# EAGLE design EM Harp (EAGLE 9.0.1)
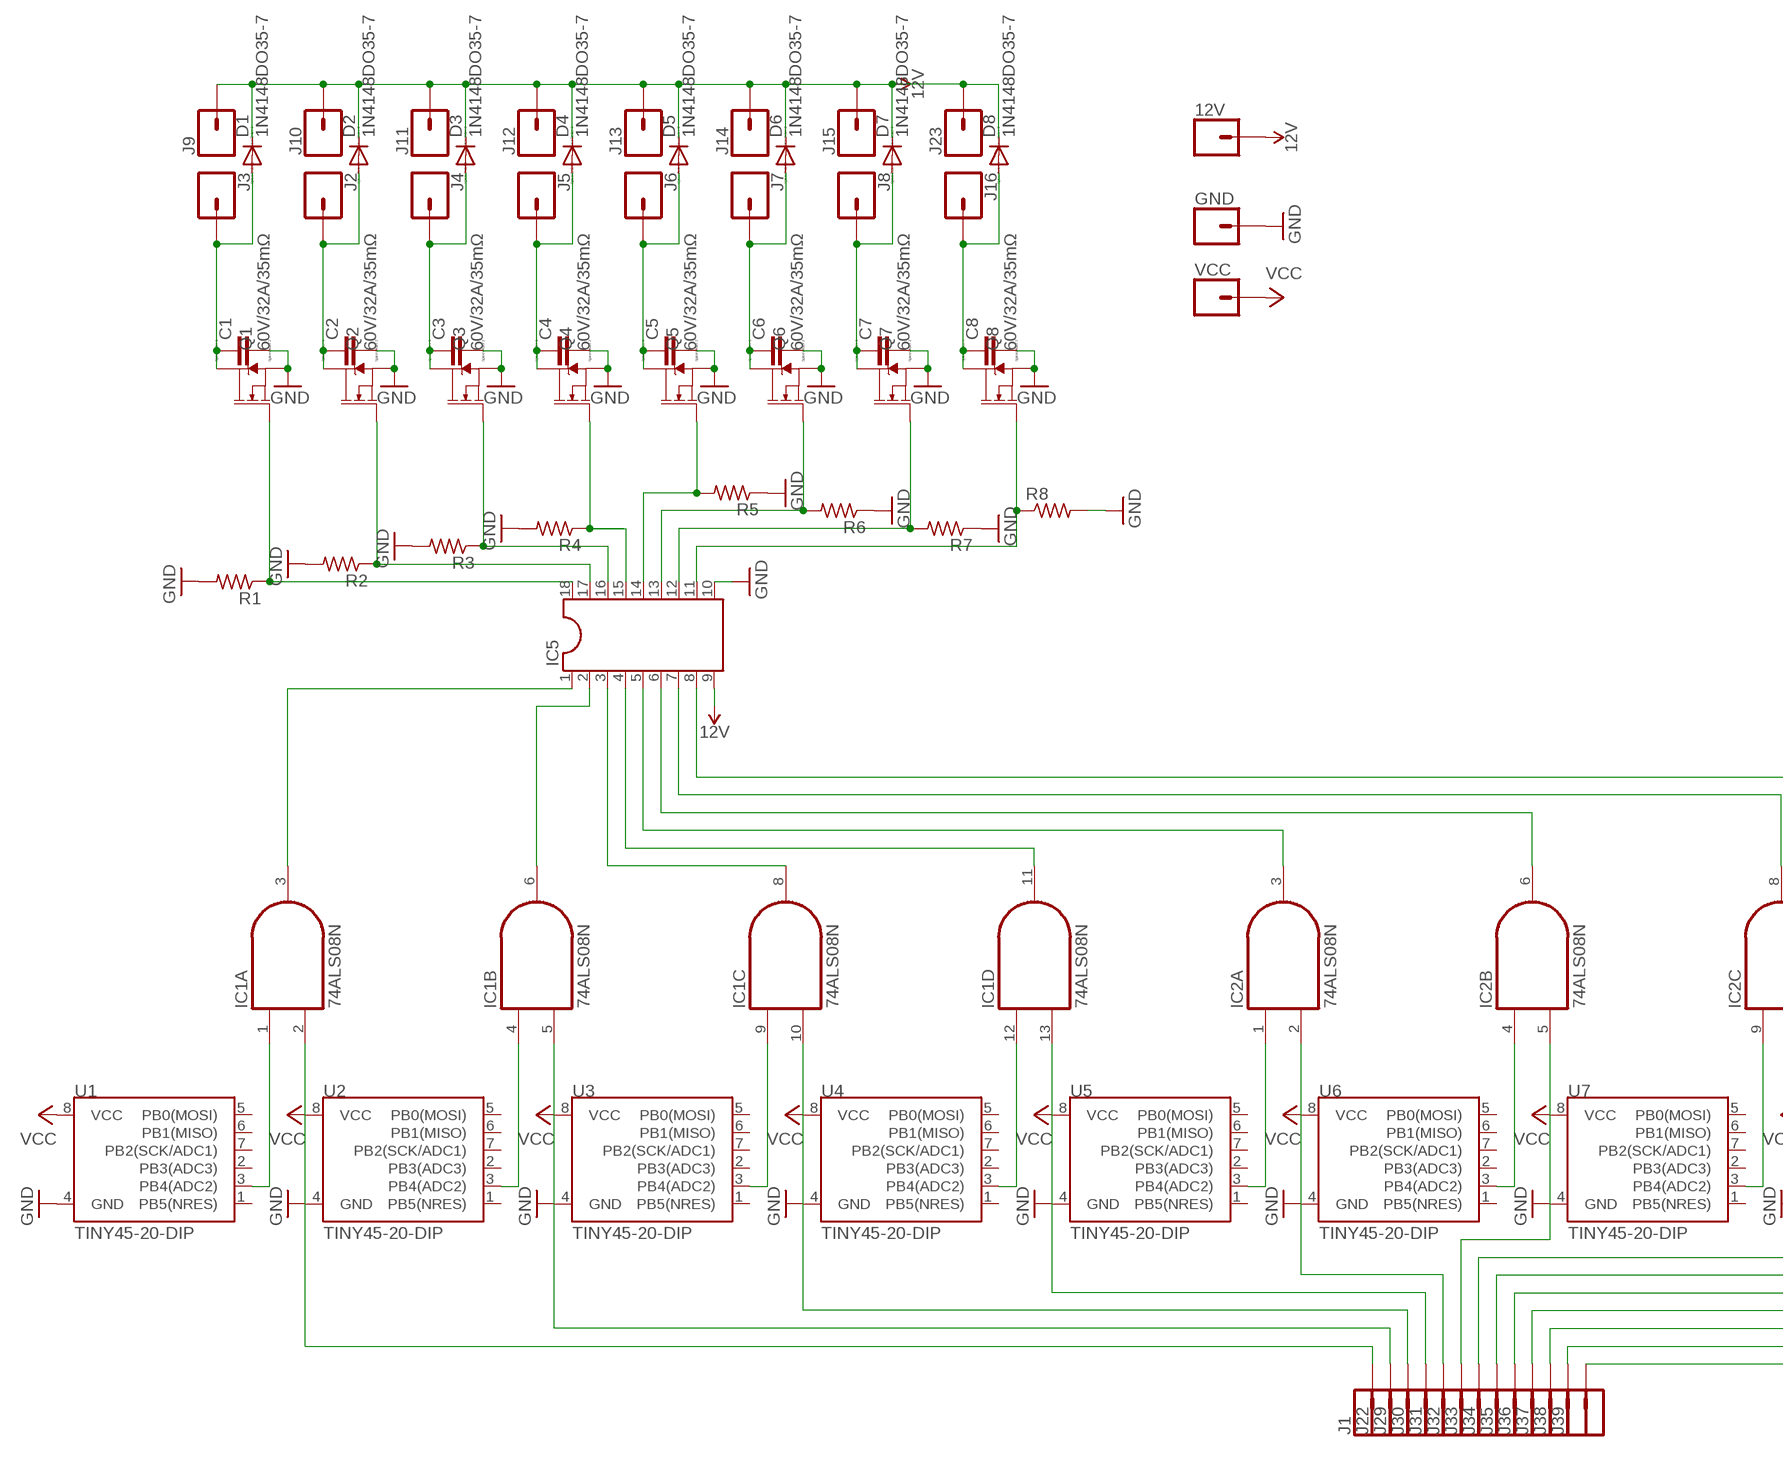
[diagram p0: schematic, sheet 1, part 1 of 2]
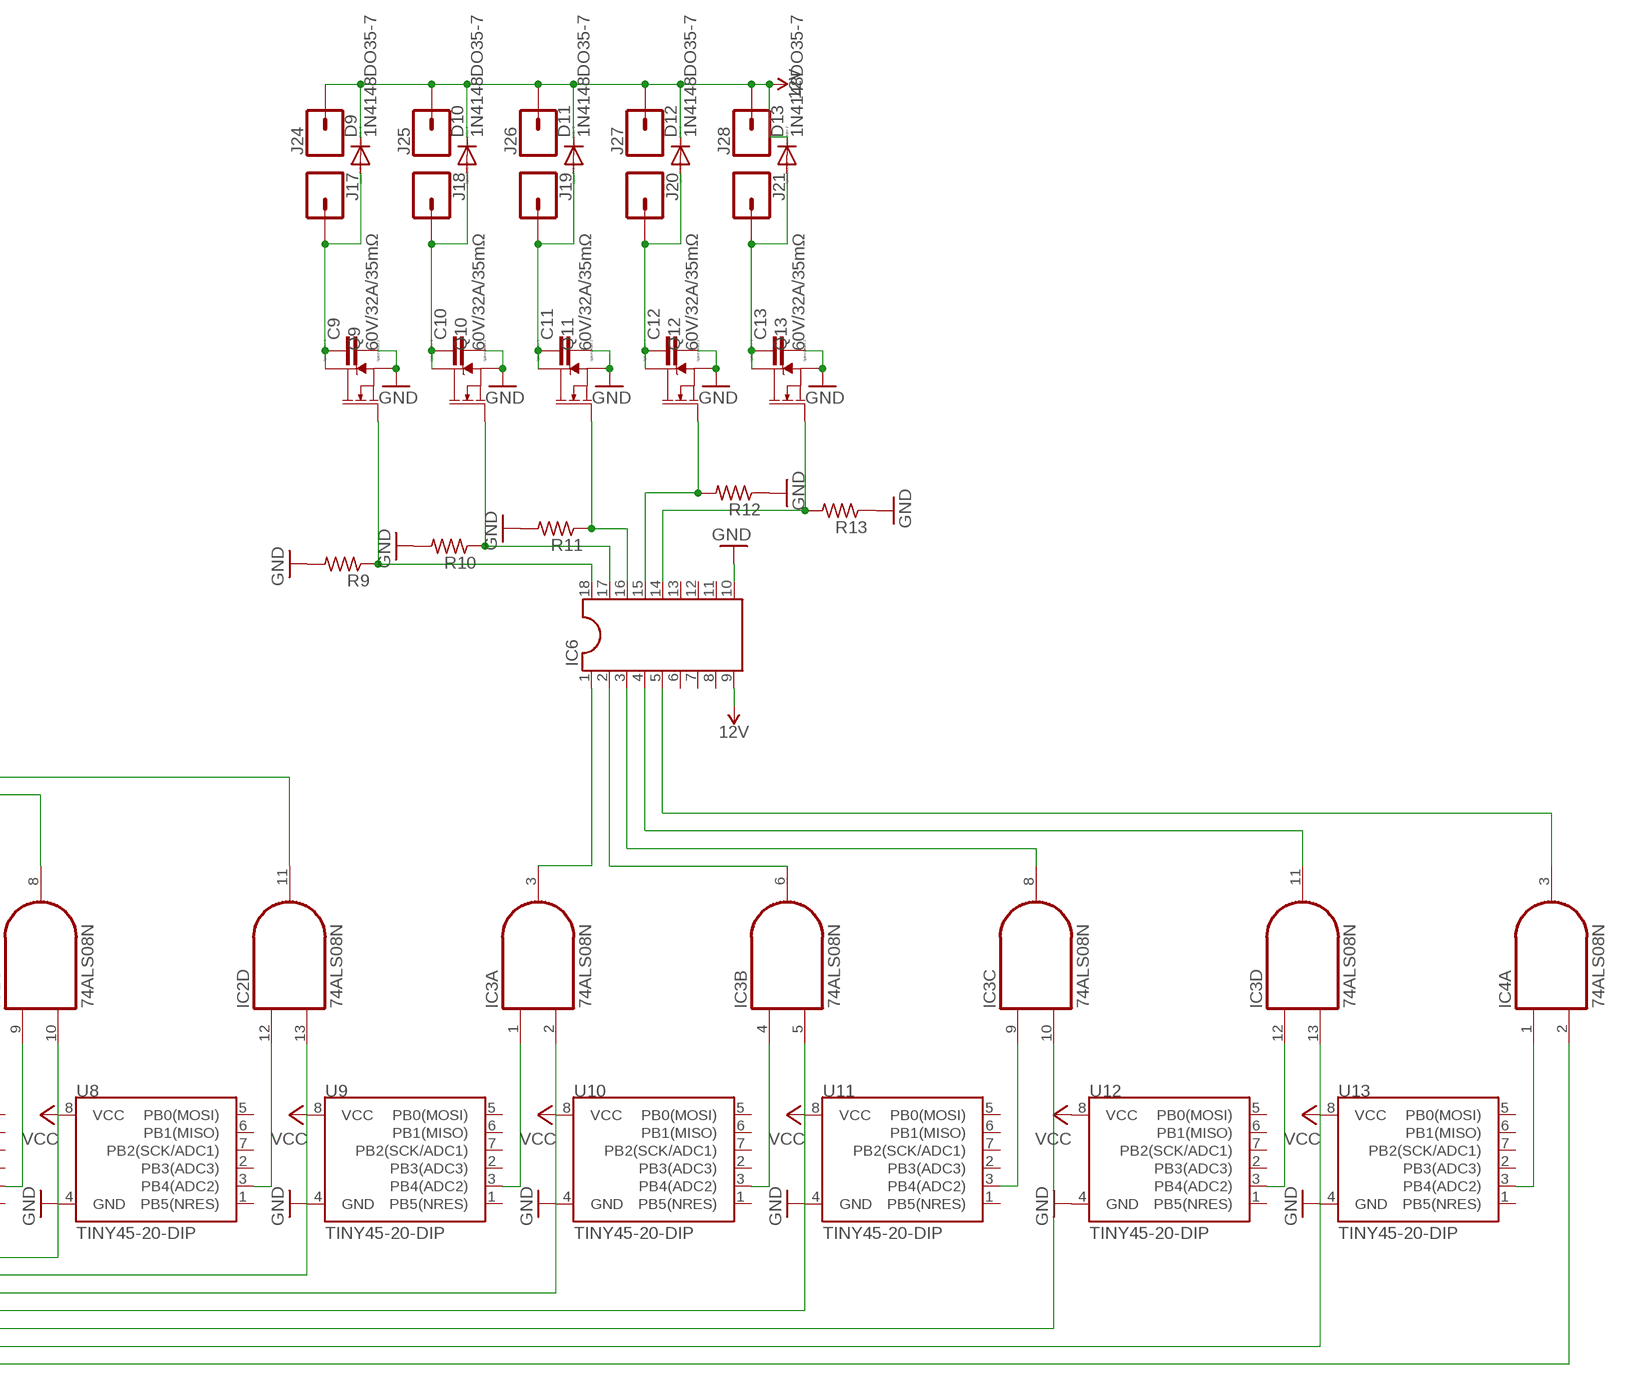
[diagram p1: schematic, sheet 1, part 2 of 2]

## Parts
12V  CONN_01  [1X01]
C1  C  [C0805]
C2  C  [C0805]
C3  C  [C0805]
C4  C  [C0805]
C5  C  [C0805]
C6  C  [C0805]
C7  C  [C0805]
C8  C  [C0805]
C9  C  [C0805]
C10  C  [C0805]
C11  C  [C0805]
C12  C  [C0805]
C13  C  [C0805]
D1  1N4148DO35-7  [DO35-7]
D2  1N4148DO35-7  [DO35-7]
D3  1N4148DO35-7  [DO35-7]
D4  1N4148DO35-7  [DO35-7]
D5  1N4148DO35-7  [DO35-7]
D6  1N4148DO35-7  [DO35-7]
D7  1N4148DO35-7  [DO35-7]
D8  1N4148DO35-7  [DO35-7]
D9  1N4148DO35-7  [DO35-7]
D10  1N4148DO35-7  [DO35-7]
D11  1N4148DO35-7  [DO35-7]
D12  1N4148DO35-7  [DO35-7]
D13  1N4148DO35-7  [DO35-7]
GND  CONN_01  [1X01]
IC1  74ALS08N  [DIL14]
IC2  74ALS08N  [DIL14]
IC3  74ALS08N  [DIL14]
IC4  74ALS08N  [DIL14]
IC5  DIL18  [DIL18]
IC6  DIL18  [DIL18]
J1  CONN_01  [1X01]
J2  CONN_01  [1X01]
J3  CONN_01  [1X01]
J4  CONN_01  [1X01]
J5  CONN_01  [1X01]
J6  CONN_01  [1X01]
J7  CONN_01  [1X01]
J8  CONN_01  [1X01]
J9  CONN_01  [1X01]
J10  CONN_01  [1X01]
J11  CONN_01  [1X01]
J12  CONN_01  [1X01]
J13  CONN_01  [1X01]
J14  CONN_01  [1X01]
J15  CONN_01  [1X01]
J16  CONN_01  [1X01]
J17  CONN_01  [1X01]
J18  CONN_01  [1X01]
J19  CONN_01  [1X01]
J20  CONN_01  [1X01]
J21  CONN_01  [1X01]
J22  CONN_01  [1X01]
J23  CONN_01  [1X01]
J24  CONN_01  [1X01]
J25  CONN_01  [1X01]
J26  CONN_01  [1X01]
J27  CONN_01  [1X01]
J28  CONN_01  [1X01]
J29  CONN_01  [1X01]
J30  CONN_01  [1X01]
J31  CONN_01  [1X01]
J32  CONN_01  [1X01]
J33  CONN_01  [1X01]
J34  CONN_01  [1X01]
J35  CONN_01  [1X01]
J36  CONN_01  [1X01]
J37  CONN_01  [1X01]
J38  CONN_01  [1X01]
J39  CONN_01  [1X01]
Q1  60V/32A/35mΩ  MOSFET-NCH-FQP30N06L  [TO220V]
Q2  60V/32A/35mΩ  MOSFET-NCH-FQP30N06L  [TO220V]
Q3  60V/32A/35mΩ  MOSFET-NCH-FQP30N06L  [TO220V]
Q4  60V/32A/35mΩ  MOSFET-NCH-FQP30N06L  [TO220V]
Q5  60V/32A/35mΩ  MOSFET-NCH-FQP30N06L  [TO220V]
Q6  60V/32A/35mΩ  MOSFET-NCH-FQP30N06L  [TO220V]
Q7  60V/32A/35mΩ  MOSFET-NCH-FQP30N06L  [TO220V]
Q8  60V/32A/35mΩ  MOSFET-NCH-FQP30N06L  [TO220V]
Q9  60V/32A/35mΩ  MOSFET-NCH-FQP30N06L  [TO220V]
Q10  60V/32A/35mΩ  MOSFET-NCH-FQP30N06L  [TO220V]
Q11  60V/32A/35mΩ  MOSFET-NCH-FQP30N06L  [TO220V]
Q12  60V/32A/35mΩ  MOSFET-NCH-FQP30N06L  [TO220V]
Q13  60V/32A/35mΩ  MOSFET-NCH-FQP30N06L  [TO220V]
R1  R-US_M0805  [M0805]
R2  R-US_R0805  [R0805]
R3  R-US_R0805  [R0805]
R4  R-US_R0805  [R0805]
R5  R-US_R0805  [R0805]
R6  R-US_R0805  [R0805]
R7  R-US_R0805  [R0805]
R8  R-US_R0805  [R0805]
R9  R-US_R0805  [R0805]
R10  R-US_R0805  [R0805]
R11  R-US_R0805  [R0805]
R12  R-US_R0805  [R0805]
R13  R-US_R0805  [R0805]
U1  TINY45-20-DIP  ATTINY45TINY45-20-DIP  [DIP08_MCU]
U2  TINY45-20-DIP  ATTINY45TINY45-20-DIP  [DIP08_MCU]
U3  TINY45-20-DIP  ATTINY45TINY45-20-DIP  [DIP08_MCU]
U4  TINY45-20-DIP  ATTINY45TINY45-20-DIP  [DIP08_MCU]
U5  TINY45-20-DIP  ATTINY45TINY45-20-DIP  [DIP08_MCU]
U6  TINY45-20-DIP  ATTINY45TINY45-20-DIP  [DIP08_MCU]
U7  TINY45-20-DIP  ATTINY45TINY45-20-DIP  [DIP08_MCU]
U8  TINY45-20-DIP  ATTINY45TINY45-20-DIP  [DIP08_MCU]
U9  TINY45-20-DIP  ATTINY45TINY45-20-DIP  [DIP08_MCU]
U10  TINY45-20-DIP  ATTINY45TINY45-20-DIP  [DIP08_MCU]
U11  TINY45-20-DIP  ATTINY45TINY45-20-DIP  [DIP08_MCU]
U12  TINY45-20-DIP  ATTINY45TINY45-20-DIP  [DIP08_MCU]
U13  TINY45-20-DIP  ATTINY45TINY45-20-DIP  [DIP08_MCU]
VCC  CONN_01  [1X01]

## Nets
12V: 12V.1 D1.C D2.C D3.C D4.C D5.C D6.C D7.C D8.C D9.C D10.C D11.C D12.C D13.C IC5.9 IC6.9 J9.1 J10.1 J11.1 J12.1 J13.1 J14.1 J15.1 J23.1 J24.1 J25.1 J26.1 J27.1 J28.1
GND: C1.2 C2.2 C3.2 C4.2 C5.2 C6.2 C7.2 C8.2 C9.2 C10.2 C11.2 C12.2 C13.2 GND.1 IC5.10 IC6.10 Q1.3(S) Q2.3(S) Q3.3(S) Q4.3(S) Q5.3(S) Q6.3(S) Q7.3(S) Q8.3(S) Q9.3(S) Q10.3(S) Q11.3(S) Q12.3(S) Q13.3(S) R1.2 R2.2 R3.2 R4.2 R5.1 R6.1 R7.1 R8.2 R9.2 R10.2 R11.2 R12.1 R13.1 U1.4(GND) U2.4(GND) U3.4(GND) U4.4(GND) U5.4(GND) U6.4(GND) U7.4(GND) U8.4(GND) U9.4(GND) U10.4(GND) U11.4(GND) U12.4(GND) U13.4(GND)
N$1: IC1.1(A:I0) U1.3(PB4(ADC2))
N$2: IC1.4(B:I0) U2.3(PB4(ADC2))
N$3: IC1.9(C:I0) U3.3(PB4(ADC2))
N$4: IC1.12(D:I0) U4.3(PB4(ADC2))
N$5: IC2.1(A:I0) U5.3(PB4(ADC2))
N$6: IC2.4(B:I0) U6.3(PB4(ADC2))
N$7: IC2.9(C:I0) U7.3(PB4(ADC2))
N$8: IC2.12(D:I0) U8.3(PB4(ADC2))
N$9: IC3.1(A:I0) U9.3(PB4(ADC2))
N$10: IC3.4(B:I0) U10.3(PB4(ADC2))
N$11: IC3.9(C:I0) U11.3(PB4(ADC2))
N$12: IC3.12(D:I0) U12.3(PB4(ADC2))
N$13: IC4.1(A:I0) U13.3(PB4(ADC2))
N$14: IC1.2(A:I1) J1.1
N$15: IC1.5(B:I1) J22.1
N$16: IC1.10(C:I1) J29.1
N$17: IC1.13(D:I1) J30.1
N$18: IC2.2(A:I1) J31.1
N$19: IC2.5(B:I1) J32.1
N$20: IC2.10(C:I1) J33.1
N$21: IC2.13(D:I1) J34.1
N$22: IC3.2(A:I1) J35.1
N$23: IC3.5(B:I1) J36.1
N$24: IC3.10(C:I1) J37.1
N$25: IC3.13(D:I1) J38.1
N$26: IC4.2(A:I1) J39.1
N$27: IC1.3(A:O) IC5.1
N$28: IC1.6(B:O) IC5.2
N$29: IC1.8(C:O) IC5.3
N$30: IC1.11(D:O) IC5.4
N$31: IC2.3(A:O) IC5.5
N$32: IC2.6(B:O) IC5.6
N$33: IC2.8(C:O) IC5.7
N$34: IC2.11(D:O) IC5.8
N$35: IC3.3(A:O) IC6.1
N$37: IC3.6(B:O) IC6.2
N$38: IC3.8(C:O) IC6.3
N$39: IC3.11(D:O) IC6.4
N$40: IC4.3(A:O) IC6.5
N$42: IC5.18 Q1.1(G) R1.1
N$43: IC5.17 Q2.1(G) R2.1
N$44: IC5.16 Q3.1(G) R3.1
N$45: IC5.15 Q4.1(G) R4.1
N$46: IC5.14 Q5.1(G) R5.2
N$47: IC5.13 Q6.1(G) R6.2
N$48: IC5.12 Q7.1(G) R7.2
N$49: C1.1 D1.A J3.1 Q1.2(D)
N$51: IC6.18 Q9.1(G) R9.1
N$52: IC6.17 Q10.1(G) R10.1
N$53: IC6.16 Q11.1(G) R11.1
N$54: IC6.15 Q12.1(G) R12.2
N$55: IC6.14 Q13.1(G) R13.2
N$57: C7.1 D7.A J8.1 Q7.2(D)
N$58: C6.1 D6.A J7.1 Q6.2(D)
N$59: C5.1 D5.A J6.1 Q5.2(D)
N$60: C4.1 D4.A J5.1 Q4.2(D)
N$61: C3.1 D3.A J4.1 Q3.2(D)
N$62: C2.1 D2.A J2.1 Q2.2(D)
N$63: C8.1 D8.A J16.1 Q8.2(D)
N$65: C13.1 D13.A J21.1 Q13.2(D)
N$66: C12.1 D12.A J20.1 Q12.2(D)
N$67: C11.1 D11.A J19.1 Q11.2(D)
N$68: C10.1 D10.A J18.1 Q10.2(D)
N$69: C9.1 D9.A J17.1 Q9.2(D)
N$79: IC5.11 Q8.1(G) R8.1
VCC: U1.8(VCC) U2.8(VCC) U3.8(VCC) U4.8(VCC) U5.8(VCC) U6.8(VCC) U7.8(VCC) U8.8(VCC) U9.8(VCC) U10.8(VCC) U11.8(VCC) U12.8(VCC) U13.8(VCC) VCC.1
Unconnected: IC4.4(B:I0) IC4.5(B:I1) IC4.6(B:O) IC4.8(C:O) IC4.9(C:I0) IC4.10(C:I1) IC4.11(D:O) IC4.12(D:I0) IC4.13(D:I1) IC6.6 IC6.7 IC6.8 IC6.11 IC6.12 IC6.13 U1.1(PB5(NRES)) U1.2(PB3(ADC3)) U1.5(PB0(MOSI)) U1.6(PB1(MISO)) U1.7(PB2(SCK/ADC1)) U2.1(PB5(NRES)) U2.2(PB3(ADC3)) U2.5(PB0(MOSI)) U2.6(PB1(MISO)) U2.7(PB2(SCK/ADC1)) U3.1(PB5(NRES)) U3.2(PB3(ADC3)) U3.5(PB0(MOSI)) U3.6(PB1(MISO)) U3.7(PB2(SCK/ADC1)) U4.1(PB5(NRES)) U4.2(PB3(ADC3)) U4.5(PB0(MOSI)) U4.6(PB1(MISO)) U4.7(PB2(SCK/ADC1)) U5.1(PB5(NRES)) U5.2(PB3(ADC3)) U5.5(PB0(MOSI)) U5.6(PB1(MISO)) U5.7(PB2(SCK/ADC1)) U6.1(PB5(NRES)) U6.2(PB3(ADC3)) U6.5(PB0(MOSI)) U6.6(PB1(MISO)) U6.7(PB2(SCK/ADC1)) U7.1(PB5(NRES)) U7.2(PB3(ADC3)) U7.5(PB0(MOSI)) U7.6(PB1(MISO)) U7.7(PB2(SCK/ADC1)) U8.1(PB5(NRES)) U8.2(PB3(ADC3)) U8.5(PB0(MOSI)) U8.6(PB1(MISO)) U8.7(PB2(SCK/ADC1)) U9.1(PB5(NRES)) U9.2(PB3(ADC3)) U9.5(PB0(MOSI)) U9.6(PB1(MISO)) U9.7(PB2(SCK/ADC1)) U10.1(PB5(NRES)) U10.2(PB3(ADC3)) U10.5(PB0(MOSI)) U10.6(PB1(MISO)) U10.7(PB2(SCK/ADC1)) U11.1(PB5(NRES)) U11.2(PB3(ADC3)) U11.5(PB0(MOSI)) U11.6(PB1(MISO)) U11.7(PB2(SCK/ADC1)) U12.1(PB5(NRES)) U12.2(PB3(ADC3)) U12.5(PB0(MOSI)) U12.6(PB1(MISO)) U12.7(PB2(SCK/ADC1)) U13.1(PB5(NRES)) U13.2(PB3(ADC3)) U13.5(PB0(MOSI)) U13.6(PB1(MISO)) U13.7(PB2(SCK/ADC1))

## Power pins joined to a net without a drawn wire
GND: IC1.7(P:GND) IC2.7(P:GND) IC3.7(P:GND) IC4.7(P:GND)
VCC: IC1.14(P:VCC) IC2.14(P:VCC) IC3.14(P:VCC) IC4.14(P:VCC)

## Library data of the parts
12V GND J1-J39 VCC = SparkFun-Connectors:CONN_01: Single connection point. Often used as Generic Header-pin footprint for 0.1 inch spaced/style header connections On any of the 0.1 inch spaced packages, you can populate with these: Break Away Headers - Straight <https://www.sparkfun.com/products/116> (PRT-00116) Break Away Male Headers - Right Angle <https://www.sparkfun.com/products/553> (PRT-00553) Female Headers <https://www.sparkfun.com/products/115> (PRT-00115) Break Away Headers - Machine Pin <https://www.sparkfun.com/products/117> (PRT-00117) Break Away Female Headers - Swiss Machine Pin <https://www.sparkfun.com/products/743> (PRT-00743) This device is also useful as a general connection point to wire up your design to another part of your project. Our various solder wires solder well into these plated through hole pads. Hook-Up Wire - Assortment (Stranded, 22 AWG) <https://www.sparkfun.com/products/11375> (PRT-11375) Hook-Up Wire - Assortment (Solid Core, 22 AWG) <https://www.sparkfun.com/products/11367> (PRT-11367) View the entire wire category on our website here <https://www.sparkfun.com/categories/141> Special notes: SMTSO-256-ET is a "flush mount" nut for a 4-40 screw. We mostly use this on specialty testbeds; it is a nice way to connect hardware to your PCB at an adjustable hieght. Also note, the SNAP packages are for using a snappable style connector. We sell a baggie of snaps and they are also used on two LilyPad designs: Snap Assortment - 30 pack (male and female) <https://www.sparkfun.com/products/11347> (DEV-11347) LilyPad Arduino SimpleSnap <https://www.sparkfun.com/products/10941> (DEV-10941) LilyPad SimpleSnap Protoboard <https://www.sparkfun.com/products/10940> (DEV-10940)
C1-C13 = eagle-ltspice:C: CAPACITOR, European symbol; SPICEMODEL: NONE; SPICEPREFIX: C
D1-D13 = diode:1N4148: DIODE high speed (Philips)
IC1-IC4 = 74xx-us:74*08: Quad 2-input AND gate
IC5 IC6 = ic-package:DIL18: Dual In Line / Socket
Q1-Q13 = SparkFun-DiscreteSemi:MOSFET-NCH: N-channel MOSFETs Voltage controlled devices that allow control of high current outputs. SparkFun Products: SparkFun OpenScale <https://www.sparkfun.com/products/13261> SparkFun Digital Sandbox <https://www.sparkfun.com/products/12651> SparkFun Monster Moto Shield <https://www.sparkfun.com/products/10182> SparkFun MOSFET Power Controller <https://www.sparkfun.com/products/11214>; PROD_ID: TRANS-10060
R1-R13 = rcl:R-US_: RESISTOR, American symbol; SPICEPREFIX: R
U1-U13 = SparkFun-Retired:ATTINY45: Atmel 8-pin 2/4/8kB flash uC Retired; PROD_ID: IC-09439

## Board
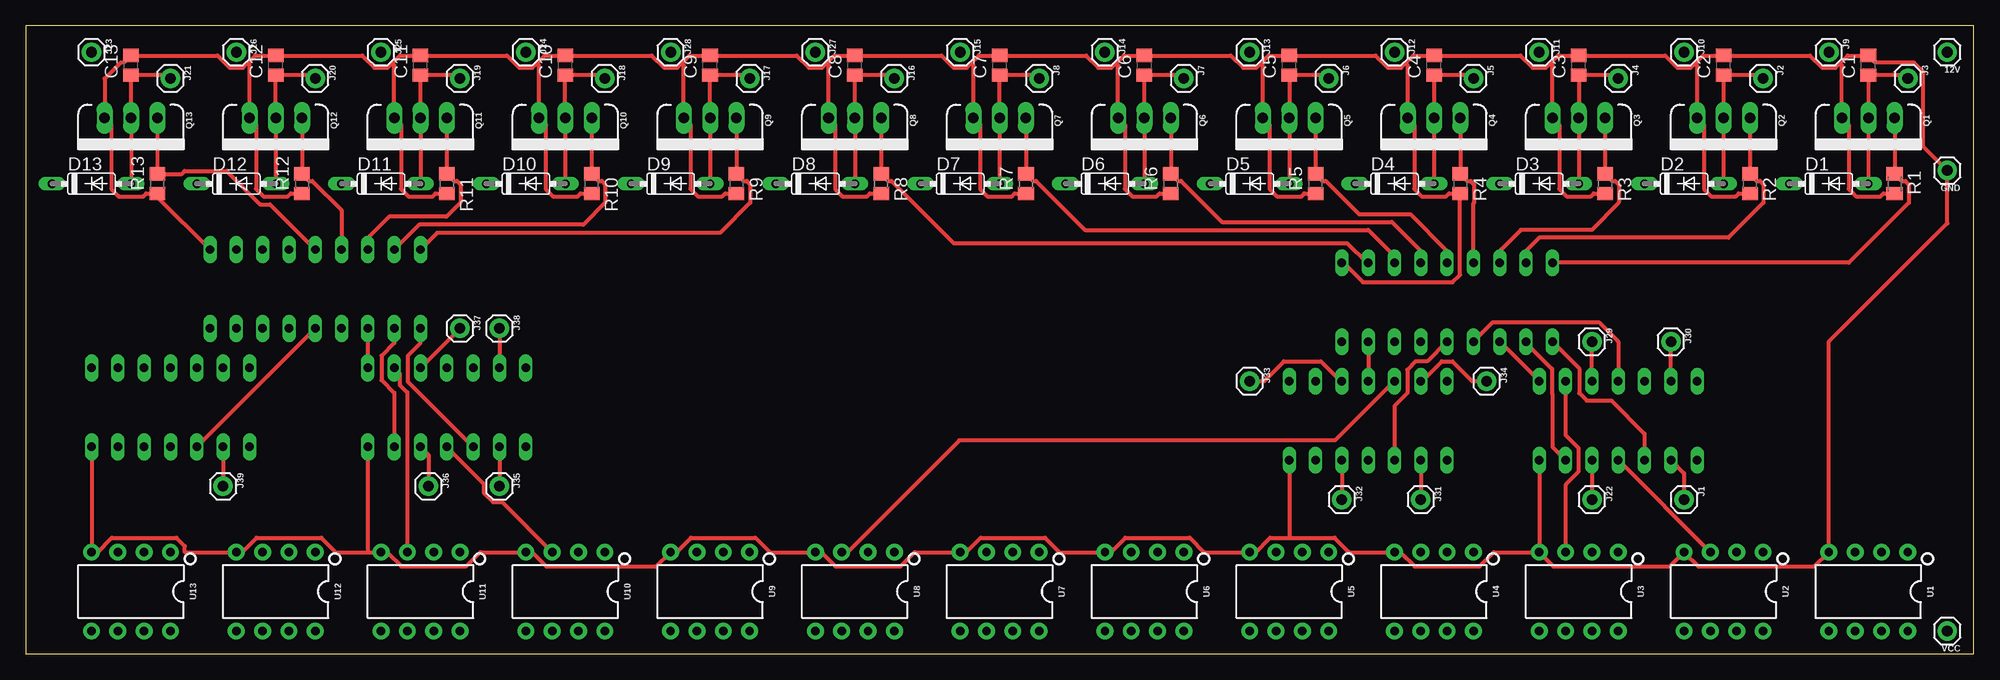
[diagram p2: board, top side]
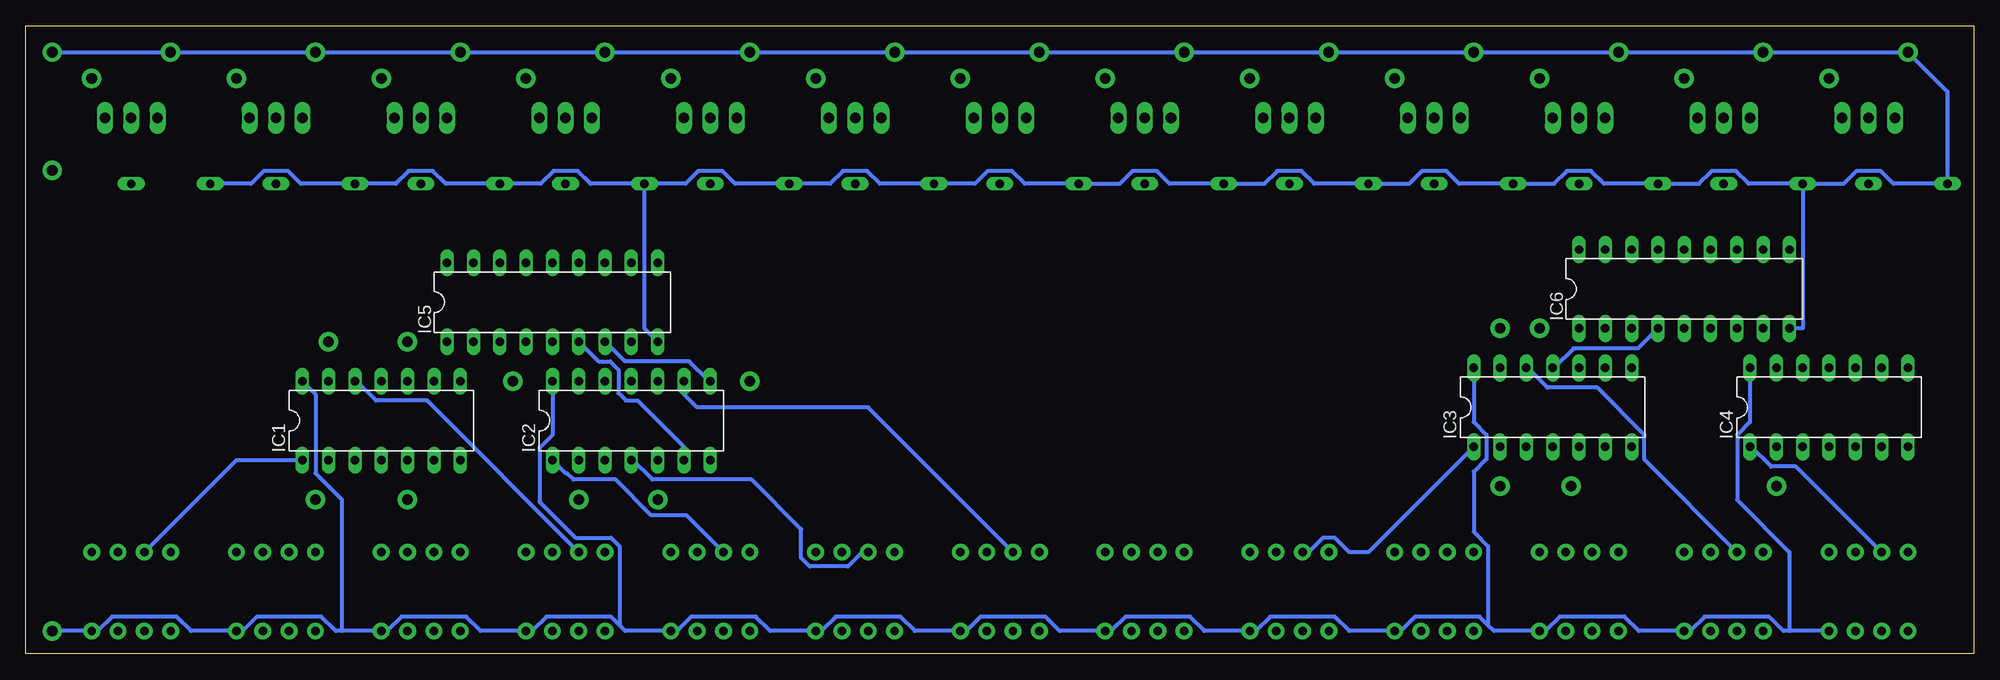
[diagram p3: board, bottom side, seen from below]

Size 187.94 x 60.63 mm. Coordinates in mm from the lower left corner, seen from the top.
Outline: 187.94,60.63 0,60.63 0,0 187.94,0 187.94,60.63
Copper layers (1*16): Top 0.035mm / dielectric 1.5mm / Bottom 0.035mm
Design rules "default *": minimum track width 10mil, minimum drill 0.35mm, track to track 15mil, track to pad 15mil, pad to pad 15mil, via to via 15mil, smd to smd 6mil, copper to edge 20mil, drill to drill 6mil, minimum pad ring 10mil, minimum via ring 8mil, stop-mask expansion 4mil, vias tented up to drill 0mil, thermal gap 10mil

### Footprints (pad centres in the part's own frame; a part is rotated, then mirrored left to right if it is on the bottom)
1X01 = drill 1.016 pad 1.88: 1 0,0
C0805 = smd 1.3 x 1.5: 1 -0.95,0; 2 0.95,0
DO35-7 = drill 0.813 long: A 3.81,0; C -3.81,0
DIL14 = drill 0.813 long: 1 -7.62,-3.81; 2 -5.08,-3.81; 3 -2.54,-3.81; 4 0,-3.81; 5 2.54,-3.81; 6 5.08,-3.81; 7 7.62,-3.81; 8 7.62,3.81; 9 5.08,3.81; 10 2.54,3.81; 11 0,3.81; 12 -2.54,3.81; 13 -5.08,3.81; 14 -7.62,3.81
DIL18 = drill 0.813 long: 1 -10.16,-3.81; 2 -7.62,-3.81; 3 -5.08,-3.81; 4 -2.54,-3.81; 5 0,-3.81; 6 2.54,-3.81; 7 5.08,-3.81; 8 7.62,-3.81; 9 10.16,-3.81; 10 10.16,3.81; 11 7.62,3.81; 12 5.08,3.81; 13 2.54,3.81; 14 0,3.81; 15 -2.54,3.81; 16 -5.08,3.81; 17 -7.62,3.81; 18 -10.16,3.81
TO220V = drill 1.016 long: 1 -2.54,0; 2 0,0; 3 2.54,0
M0805 = smd 1.3 x 1.6: 1 -0.95,0; 2 0.95,0
R0805 = smd 1.3 x 1.5: 1 -0.95,0; 2 0.95,0
DIP08_MCU = drill 0.813 pad 1.626: 1 -3.81,-3.81; 2 -1.27,-3.81; 3 1.27,-3.81; 4 3.81,-3.81; 5 3.81,3.81; 6 1.27,3.81; 7 -1.27,3.81; 8 -3.81,3.81

### Placement (x,y rotation side)
12V  185.4,58.09 180 top
C1  177.78,56.82 90 top
C2  163.81,56.82 90 top
C3  149.84,56.82 90 top
C4  135.87,56.82 90 top
C5  121.9,56.82 90 top
C6  107.93,56.82 90 top
C7  93.96,56.82 90 top
C8  79.99,56.82 90 top
C9  66.02,56.82 90 top
C10  52.05,56.82 90 top
C11  38.08,56.82 90 top
C12  24.11,56.82 90 top
C13  10.14,56.82 90 top
D1  173.97,45.39 0 top
D2  160,45.39 0 top
D3  146.03,45.39 0 top
D4  132.06,45.39 0 top
D5  118.09,45.39 0 top
D6  104.12,45.39 0 top
D7  90.15,45.39 0 top
D8  76.18,45.39 0 top
D9  62.21,45.39 0 top
D10  48.24,45.39 0 top
D11  34.27,45.39 0 top
D12  20.3,45.39 0 top
D13  6.33,45.39 0 top
GND  185.4,46.66 180 top
IC1  153.65,22.53 0 bottom
IC2  129.52,22.53 0 bottom
IC3  40.62,23.8 0 bottom
IC4  13.95,23.8 0 bottom
IC5  137.14,33.96 0 bottom
IC6  27.92,35.23 0 bottom
J1  160,14.91 270 top
J2  167.62,55.55 270 top
J3  181.59,55.55 270 top
J4  153.65,55.55 270 top
J5  139.68,55.55 270 top
J6  125.71,55.55 270 top
J7  111.74,55.55 270 top
J8  97.77,55.55 270 top
J9  173.97,58.09 270 top
J10  160,58.09 270 top
J11  146.03,58.09 270 top
J12  132.06,58.09 270 top
J13  118.09,58.09 270 top
J14  104.12,58.09 270 top
J15  90.15,58.09 270 top
J16  83.8,55.55 270 top
J17  69.83,55.55 270 top
J18  55.86,55.55 270 top
J19  41.89,55.55 270 top
J20  27.92,55.55 270 top
J21  13.95,55.55 270 top
J22  151.11,14.91 270 top
J23  6.33,58.09 270 top
J24  48.24,58.09 270 top
J25  34.27,58.09 270 top
J26  20.3,58.09 270 top
J27  76.18,58.09 270 top
J28  62.21,58.09 270 top
J29  151.11,30.15 270 top
J30  158.73,30.15 270 top
J31  134.6,14.91 270 top
J32  126.98,14.91 270 top
J33  118.09,26.34 270 top
J34  140.95,26.34 270 top
J35  45.7,16.18 270 top
J36  38.84,16.18 270 top
J37  41.89,31.42 270 top
J38  45.7,31.42 270 top
J39  19.03,16.18 270 top
Q1  177.78,51.74 180 top
Q2  163.81,51.74 180 top
Q3  149.84,51.74 180 top
Q4  135.87,51.74 180 top
Q5  121.9,51.74 180 top
Q6  107.93,51.74 180 top
Q7  93.96,51.74 180 top
Q8  79.99,51.74 180 top
Q9  66.02,51.74 180 top
Q10  52.05,51.74 180 top
Q11  38.08,51.74 180 top
Q12  24.11,51.74 180 top
Q13  10.14,51.74 180 top
R1  180.32,45.39 270 top
R2  166.35,45.39 270 top
R3  152.38,45.39 270 top
R4  138.41,45.39 270 top
R5  124.44,45.39 90 top
R6  110.47,45.39 90 top
R7  96.5,45.39 90 top
R8  82.53,45.39 270 top
R9  68.56,45.39 270 top
R10  54.59,45.39 270 top
R11  40.62,45.39 270 top
R12  26.65,45.39 90 top
R13  12.68,45.39 90 top
U1  177.78,6.02 180 top
U2  163.81,6.02 180 top
U3  149.84,6.02 180 top
U4  135.87,6.02 180 top
U5  121.9,6.02 180 top
U6  107.93,6.02 180 top
U7  93.96,6.02 180 top
U8  79.99,6.02 180 top
U9  66.02,6.02 180 top
U10  52.05,6.02 180 top
U11  38.08,6.02 180 top
U12  24.11,6.02 180 top
U13  10.14,6.02 180 top
VCC  185.4,2.21 180 top

### Tracks (layer width: path | path; a pad name or v marks a point on that pad's centre or on a via)
12V
  Bottom 0.381: D12.C 21.71,45.39 22.94,46.62 25.28,46.62 26.51,45.39 D11.C 35.68,45.39 36.91,46.62 39.25,46.62 40.48,45.39 D10.C 49.65,45.39 50.88,46.62 53.22,46.62 54.45,45.39 D9.C 63.62,45.39 64.85,46.62 67.19,46.62 68.42,45.39 D8.C 77.59,45.39 78.82,46.62 81.16,46.62 82.39,45.39 D7.C 91.56,45.39 92.79,46.62 95.13,46.62 96.36,45.39 D6.C | 101.58,45.39 D6.C | D6.C 105.53,45.39 106.76,46.62 109.1,46.62 110.33,45.39 D5.C 119.5,45.39 120.73,46.62 123.07,46.62 124.3,45.39 D4.C | D4.C 133.47,45.39 134.7,46.62 137.04,46.62 138.27,45.39 D3.C 147.44,45.39 148.67,46.62 151.01,46.62 152.24,45.39 D2.C 161.41,45.39 162.64,46.62 164.98,46.62 166.21,45.39 D1.C | 12V.1 J9.1 J10.1 J11.1 J12.1 J13.1 J14.1 J15.1 J27.1 J28.1 J24.1 J25.1 J26.1 J23.1 2.52,54.28 D13.C 7.74,45.39 8.97,46.62 11.31,46.62 12.54,45.39 D12.C | IC5.9 128.25,31.42 D4.C | D12.C 16.49,31.42 IC6.9
GND
  Top 0.381: 21.57,57.22 20.93,56.58 19.67,56.58 18.48,57.77 C13.2 9.46,57.09 9.15,57.09 7.6,55.54 Q13.3 8.25,51.09 8.25,44.88 8.97,44.16 11.31,44.16 11.59,44.44 R13.1 12.68,44.12 IC6.10 | 35.34,57.02 34.9,56.58 33.64,56.58 32.45,57.77 C12.2 22.12,57.77 21.57,57.22 | 35.34,57.02 36.09,57.77 C11.2 46.42,57.77 47.61,56.58 48.87,56.58 49.31,57.02 | 49.31,57.02 50.06,57.77 C10.2 60.39,57.77 61.58,56.58 62.84,56.58 63.28,57.02 | 63.28,57.02 64.03,57.77 C9.2 74.36,57.77 75.55,56.58 76.81,56.58 77.25,57.02 | 79.99,58.09 C8.2 | C8.2 88.33,57.77 89.52,56.58 90.78,56.58 91.22,57.02 | 91.22,57.02 91.97,57.77 C7.2 102.3,57.77 103.49,56.58 104.75,56.58 105.19,57.02 | 35.34,57.02 35.54,56.82 Q11.3 36.19,51.09 36.19,44.88 36.91,44.16 39.25,44.16 39.53,44.44 R11.2 | 21.57,57.22 Q12.3 22.22,51.09 22.22,44.88 22.94,44.16 25.28,44.16 25.56,44.44 R12.1 | 49.31,57.02 49.51,56.82 Q10.3 50.16,51.09 50.16,44.88 50.88,44.16 53.22,44.16 53.5,44.44 R10.2 | 63.28,57.02 63.48,56.82 Q9.3 64.13,51.09 64.13,44.88 64.85,44.16 67.19,44.16 67.47,44.44 R9.2 | 91.22,57.02 91.42,56.82 Q7.3 92.07,51.09 92.07,44.88 92.79,44.16 95.13,44.16 95.41,44.44 R7.1 | C8.2 78,57.77 77.25,57.02 | 77.25,57.02 77.45,56.82 Q8.3 78.1,51.09 78.1,44.88 78.82,44.16 81.16,44.16 81.44,44.44 R8.2 | 105.19,57.02 105.94,57.77 C6.2 116.27,57.77 117.46,56.58 118.72,56.58 119.16,57.02 | 119.16,57.02 119.91,57.77 C5.2 130.24,57.77 131.43,56.58 132.69,56.58 133.13,57.02 | 105.19,57.02 105.39,56.82 Q6.3 106.04,51.09 106.04,44.88 106.76,44.16 109.1,44.16 109.38,44.44 R6.1 | 119.16,57.02 119.36,56.82 Q5.3 120.01,51.09 120.01,44.88 120.73,44.16 123.07,44.16 123.35,44.44 R5.1
  Top 0.381: 133.13,57.02 133.88,57.77 C4.2 144.21,57.77 145.4,56.58 146.66,56.58 147.1,57.02 | 147.1,57.02 147.85,57.77 C3.2 158.18,57.77 159.37,56.58 160.63,56.58 161.07,57.02 | 161.07,57.02 161.82,57.77 C2.2 172.15,57.77 173.34,56.58 174.6,56.58 175.04,57.02 | 175.04,57.02 175.79,57.77 C1.2 178.46,57.09 182.19,57.09 183.1,56.18 183.1,48.96 GND.1 185.4,41.58 173.97,30.15 U1.4 172.59,8.45 161.38,8.45 U2.4 | 133.13,57.02 133.33,56.82 Q4.3 133.98,51.09 133.98,44.88 134.7,44.16 137.04,44.16 137.32,44.44 R4.2 138.37,44.4 138.37,36.6 137.65,35.88 129.01,35.88 127.12,37.77 IC5.10 | 147.1,57.02 147.3,56.82 Q3.3 147.95,51.09 147.95,44.88 148.67,44.16 151.01,44.16 151.29,44.44 R3.2 | 161.07,57.02 161.27,56.82 Q2.3 161.92,51.09 161.92,44.88 162.64,44.16 164.98,44.16 165.26,44.44 R2.2 | 175.04,57.02 175.24,56.82 Q1.3 175.89,51.09 175.89,44.88 176.61,44.16 178.95,44.16 179.23,44.44 R1.2 | 33,9.83 29.88,9.83 28.49,11.21 22.27,11.21 20.88,9.83 U12.4 15.33,9.83 15.33,10.4 14.52,11.21 8.3,11.21 6.91,9.83 U13.4 IC4.7 | 33,9.83 U11.4 34.85,9.83 36.24,8.45 42.46,8.45 43.85,9.83 U10.4 48.82,9.83 50.21,8.45 60.83,8.45 U9.4 62.79,9.83 64.18,11.21 70.4,11.21 71.79,9.83 U8.4 76.76,9.83 78.15,8.45 84.37,8.45 85.76,9.83 U7.4 90.73,9.83 92.12,11.21 98.34,11.21 99.73,9.83 U6.4 104.7,9.83 106.09,11.21 112.31,11.21 113.7,9.83 U5.4 118.67,9.83 120.06,11.21 121.9,11.21 | 121.9,11.21 126.28,11.21 127.67,9.83 U4.4 132.64,9.83 134.03,8.45 140.25,8.45 141.64,9.83 U3.4 | U3.4 146.61,9.83 | U2.4 160.58,9.83 | IC2.7 121.9,11.21 | IC3.7 33,9.83 | IC1.7 U3.4 | U3.4 147.41,8.45 158.62,8.45 U2.4
N$1
  Bottom 0.381: U1.3 167.62,18.72 IC1.1
N$2
  Top 0.381: IC1.4 U2.3
N$3
  Top 0.381: IC1.9 148.57,21.12 149.8,19.89 149.8,17.55 148.57,16.32 U3.3
N$4
  Bottom 0.381: U4.3 149.22,24.45 154.16,24.45 156.05,26.34 IC1.12
N$5
  Bottom 0.381: U5.3 124.2,13.4 127.61,13.4 131.03,16.83 135.11,16.83 135.73,17.45 135.87,17.45 IC2.1
N$6
  Bottom 0.381: IC2.4 129.38,18.72 127.49,16.83 117.93,16.83 113.12,12.03 113.12,9.26 112.31,8.45 108.63,8.45 107.24,9.83 U6.3
N$7
  Bottom 0.381: U7.3 106.66,23.8 123.17,23.8 124.44,25.07 IC2.9
N$8
  Top 0.381: U8.3 79.3,9.83 90.08,20.61 126.33,20.61 IC2.12
N$9
  Bottom 0.381: IC3.1 58.4,9.83 60.25,9.83 61.64,11.21 62.78,11.21 64.17,9.83 U9.3
N$10
  Top 0.381: IC3.4 44.19,16.42 44.19,15.55 45.07,14.67 45.94,14.67 U10.3
N$11
  Top 0.381: IC3.9 36.09,27.06 36.09,25.99 36.81,25.26 U11.3
N$12
  Bottom 0.381: U12.3 31.77,18.76 31.77,21.16 36.33,25.72 41.13,25.72 43.02,27.61 IC3.12
N$13
  Bottom 0.381: U13.3 17.14,18.1 19.54,18.1 21.43,19.99 IC4.1
N$14
  Top 0.381: IC1.2 160,17.45 J1.1
N$15
  Top 0.381: IC1.5 J22.1
N$16
  Top 0.381: IC1.10 J29.1 151.05,30.21
N$17
  Top 0.381: IC1.13 J30.1
N$18
  Top 0.381: IC2.2 J31.1
N$19
  Top 0.381: IC2.5 J32.1
N$20
  Top 0.381: J33.1 119.5,26.34 121.39,28.23 124.95,28.23 126.84,26.34 IC2.10
N$21
  Top 0.381: IC2.13 134.74,26.34 136.63,28.23 137.65,28.23 139.54,26.34 J34.1
N$22
  Top 0.381: IC3.2 J35.1 45.77,16.11
N$23
  Top 0.381: IC3.5 38.84,19.23 J36.1
N$24
  Top 0.381: 37.94,27.61 IC3.10 J37.1
N$25
  Top 0.381: J38.1 IC3.13
N$26
  Top 0.381: IC4.2 J39.1
N$27
  Top 0.381: IC1.3 156.19,21.26 153,24.45 150.6,24.45 149.88,25.17 149.88,27.57 IC5.1
N$28
  Top 0.381: IC5.2 144.76,30.01 147.26,27.51 147.26,25.11 147.3,25.07 147.3,19.99 IC1.6
N$29
  Top 0.381: IC5.3 IC1.8
N$30
  Top 0.381: IC5.4 141.57,32.04 151.76,32.04 153.65,30.15 IC1.11
N$31
  Top 0.381: IC5.5 135.22,28.23 134.09,28.23 133.29,27.43 133.29,25.17 132.06,23.94 IC2.3
N$32
  Bottom 0.381: IC2.6 124.44,19.99 128.9,24.45 130.03,24.45 130.75,25.17 130.75,27.43 131.55,28.23 132.68,28.23 IC5.6
N$33
  Bottom 0.381: IC2.8 122.04,26.34 123.93,28.23 130.14,28.23 IC5.7
N$34
  Top 0.381: IC5.8 IC2.11
N$35
  Top 0.381: IC6.1 38.08,30.01 36.85,28.78 36.85,26.3 IC3.3
N$37
  Top 0.381: IC6.2 35.54,30.01 34.31,28.78 34.31,26.44 35.54,25.21 IC3.6
N$38
  Top 0.381: IC6.3 IC3.8
N$39
  Bottom 0.381: IC6.4 32.38,29.5 38.59,29.5 40.48,27.61 IC3.11
N$40
  Top 0.381: IC4.3 IC6.5
N$42
  Top 0.381: Q1.1 R1.1 181,45.66 181.36,45.66 181.69,45.33 181.69,43.55 175.91,37.77 IC5.18
N$43
  Top 0.381: Q2.1 R2.1 167.03,45.66 167.34,45.66 167.67,45.33 167.67,43.55 164.29,40.17 146.03,40.17 144.76,38.9 IC5.17
N$44
  Top 0.381: Q3.1 R3.1 153.06,45.66 153.37,45.66 153.7,45.33 153.7,43.55 151.08,40.93 144.25,40.93 142.36,39.04 IC5.16
N$45
  Top 0.381: Q4.1 R4.1 139.09,45.66 139.4,45.66 139.73,45.33 139.73,43.55 139.68,43.5 IC5.15
N$46
  Top 0.381: Q5.1 R5.2 125.12,45.66 125.43,45.66 128.63,42.46 133.59,42.46 137.14,38.9 IC5.14
N$47
  Top 0.381: Q6.1 R6.2 111.15,45.66 111.46,45.66 115.42,41.69 131.81,41.69 134.6,38.9 IC5.13
N$48
  Top 0.381: Q7.1 R7.2 97.18,45.66 97.49,45.66 102.22,40.93 129.52,40.93 132.06,38.39 IC5.12
N$49
  Top 0.381: J3.1 181.27,55.87 C1.1 Q1.2 D1.A
N$51
  Top 0.381: Q9.1 R9.1 69.24,45.66 69.55,45.66 69.88,45.33 69.88,43.55 66.96,40.64 39.68,40.64 IC6.18
N$52
  Top 0.381: Q10.1 R10.1 55.27,45.66 55.58,45.66 55.91,45.33 55.91,43.55 53.8,41.44 37.94,41.44 IC6.17
N$53
  Top 0.381: Q11.1 R11.1 41.3,45.66 41.61,45.66 41.94,45.33 41.94,43.55 40.59,42.2 35.03,42.2 33.14,40.31 IC6.16
N$54
  Top 0.381: Q12.1 R12.2 27.33,45.66 27.64,45.66 30.46,42.84 IC6.15
N$55
  Top 0.381: Q13.1 R13.2 15.04,46.34 15.32,46.62 19.4,46.62 22.62,43.4 23.56,43.4 IC6.14
N$57
  Top 0.381: J8.1 97.45,55.87 C7.1 Q7.2 D7.A
N$58
  Top 0.381: J7.1 111.42,55.87 C6.1 Q6.2 D6.A
N$59
  Top 0.381: J6.1 125.39,55.87 C5.1 Q5.2 D5.A
N$60
  Top 0.381: J5.1 139.36,55.87 C4.1 Q4.2 D4.A
N$61
  Top 0.381: J4.1 153.33,55.87 C3.1 Q3.2 D3.A
N$62
  Top 0.381: J2.1 167.3,55.87 C2.1 Q2.2 D2.A
N$63
  Top 0.381: J16.1 83.48,55.87 C8.1 Q8.2 D8.A
N$65
  Top 0.381: J21.1 13.63,55.87 C13.1 Q13.2 D13.A
N$66
  Top 0.381: J20.1 27.6,55.87 C12.1 Q12.2 D12.A
N$67
  Top 0.381: J19.1 41.57,55.87 C11.1 Q11.2 D11.A
N$68
  Top 0.381: J18.1 55.54,55.87 C10.1 Q10.2 D10.A
N$69
  Top 0.381: J17.1 69.51,55.87 C9.1 Q9.2 D9.A
N$79
  Top 0.381: Q8.1 R8.1 83.21,45.66 83.52,45.66 89.52,39.66 127.49,39.66 129.38,37.77 IC5.11
VCC
  Bottom 0.381: 46.86,2.78 46.28,2.21 U11.8 41.31,2.21 39.92,3.59 33.7,3.59 32.31,2.21 U12.8 27.34,2.21 25.95,3.59 19.73,3.59 18.34,2.21 17.76,2.21 | 46.86,2.78 47.67,3.59 53.89,3.59 55.28,2.21 U10.8 60.25,2.21 61.64,3.59 67.86,3.59 69.25,2.21 U9.8 74.22,2.21 75.61,3.59 81.83,3.59 83.22,2.21 U8.8 88.19,2.21 89.58,3.59 95.8,3.59 97.19,2.21 U7.8 102.16,2.21 103.55,3.59 109.77,3.59 111.16,2.21 U6.8 116.13,2.21 117.52,3.59 123.74,3.59 125.13,2.21 U5.8 130.1,2.21 130.68,2.78 | IC3.14 48.24,22.39 47.01,21.16 47.01,18.82 48.24,17.59 48.24,11.79 46.86,10.4 46.86,2.78 | 130.68,2.78 131.49,3.59 137.71,3.59 139.1,2.21 U4.8 144.07,2.21 145.46,3.59 151.68,3.59 153.07,2.21 U3.8 157.46,2.21 | 157.46,2.21 158.04,2.21 159.43,3.59 165.65,3.59 167.04,2.21 U2.8 172.01,2.21 173.4,3.59 179.62,3.59 181.01,2.21 U1.8 VCC.1 | IC2.14 137.14,21.12 138.37,19.89 138.37,14.68 134.91,11.21 131.49,11.21 130.68,10.4 130.68,2.78 | IC1.14 160,25.07 160,17.45 157.46,14.91 157.46,2.21 | U13.8 17.76,2.21 | IC4.14 21.57,22.39 22.8,21.16 22.8,14.87 17.76,9.83 17.76,2.21